# EAGLE design IO4-IR-Detector-GBunza (EAGLE 7.7.0)
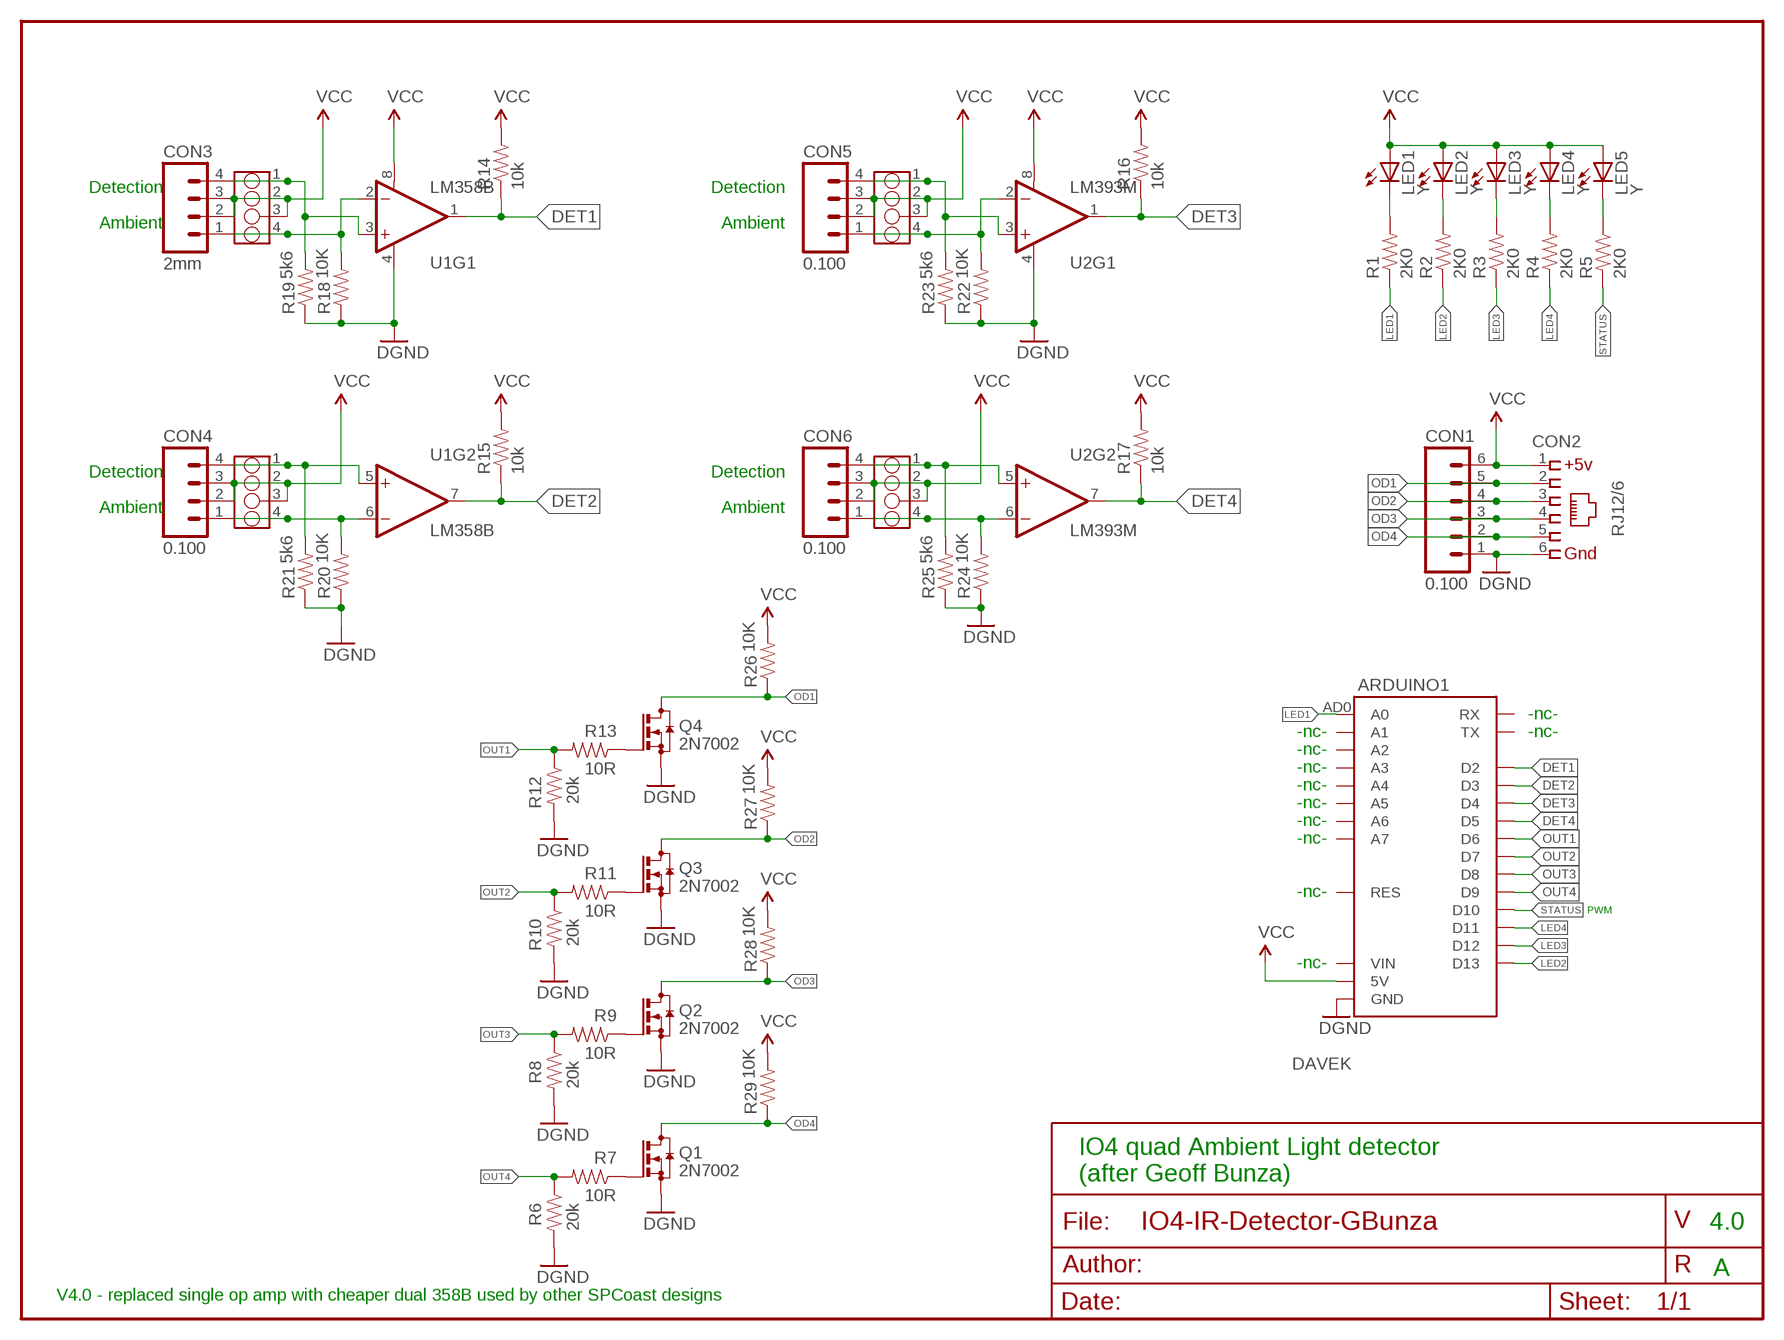
[diagram p0: schematic, sheet 1]

## Parts
ARDUINO1  DAVEK  ARDUINO-PRO-MINIDAVESROBOT  [ARDUINO_PRO_MINI_DAVEK]
CON1  0.100  CONNECTOR-M06LOCK  [1X06_LOCK]
CON2  RJ12/6  CONNECTOR-IO4INV  [RJ25-INVERTED]
CON3  2mm  CONNECTOR-M04LOCK  [1X04_LOCK]
CON4  0.100  CONNECTOR-M04LOCK  [1X04_LOCK]
CON5  0.100  CONNECTOR-M04LOCK  [1X04_LOCK]
CON6  0.100  CONNECTOR-M04LOCK  [1X04_LOCK]
DET1  2mm  CONNECTOR-GROVE-4P-2.0-3470130P1  [4P-2.0]
DET2  2mm  CONNECTOR-GROVE-4P-2.0-3470130P1  [4P-2.0]
DET3  2mm  CONNECTOR-GROVE-4P-2.0-3470130P1  [4P-2.0]
DET4  2mm  CONNECTOR-GROVE-4P-2.0-3470130P1  [4P-2.0]
LED1  Y  LED0603-LED  [0603-LED]
LED2  Y  LED0603-LED  [0603-LED]
LED3  Y  LED0603-LED  [0603-LED]
LED4  Y  LED0603-LED  [0603-LED]
LED5  Y  LED0603-LED  [0603-LED]
Q1  2N7002  BSS123  [SOT23]
Q2  2N7002  BSS123  [SOT23]
Q3  2N7002  BSS123  [SOT23]
Q4  2N7002  BSS123  [SOT23]
R1  2K0  R0603-RES  [0603-RES]
R2  2K0  R0603-RES  [0603-RES]
R3  2K0  R0603-RES  [0603-RES]
R4  2K0  R0603-RES  [0603-RES]
R5  2K0  R0603-RES  [0603-RES]
R6  20k  R0603-RES  [0603-RES]
R7  10R  R0603-RES  [0603-RES]
R8  20k  R0603-RES  [0603-RES]
R9  10R  R0603-RES  [0603-RES]
R10  20k  R0603-RES  [0603-RES]
R11  10R  R0603-RES  [0603-RES]
R12  20k  R0603-RES  [0603-RES]
R13  10R  R0603-RES  [0603-RES]
R14  10k  R0603-RES  [0603-RES]
R15  10k  R0603-RES  [0603-RES]
R16  10k  R0603-RES  [0603-RES]
R17  10k  R0603-RES  [0603-RES]
R18  10K  R0603-RES  [0603-RES]
R19  5k6  R0603-RES  [0603-RES]
R20  10K  R0603-RES  [0603-RES]
R21  5k6  R0603-RES  [0603-RES]
R22  10K  R0603-RES  [0603-RES]
R23  5k6  R0603-RES  [0603-RES]
R24  10K  R0603-RES  [0603-RES]
R25  5k6  R0603-RES  [0603-RES]
R26  10K  R0603-RES  [0603-RES]
R27  10K  R0603-RES  [0603-RES]
R28  10K  R0603-RES  [0603-RES]
R29  10K  R0603-RES  [0603-RES]
U1  LM358B  LM393M  [SO08]
U2  LM393M  [SO08]

## Nets
DET1: ARDUINO1.D2 R14.1 U1.1(OUT)
DET2: ARDUINO1.D3 R15.1 U1.7(OUT)
DET3: ARDUINO1.D4 R16.1 U2.1(OUT)
DET4: ARDUINO1.D5 R17.1 U2.7(OUT)
GND: ARDUINO1.GND@1(GND) ARDUINO1.GND@2(GND) ARDUINO1.GND@4(GND) CON1.1 CON2.6 Q1.2(S) Q2.2(S) Q3.2(S) Q4.2(S) R6.2 R8.2 R10.2 R12.2 R18.1 R19.1 R20.1 R21.1 R22.1 R23.1 R24.1 R25.1 U1.4(V-) U2.4(V-) ; supply symbol labelled DGND
LED1: ARDUINO1.AD0(A0) R1.1
LED2: ARDUINO1.D13 R2.1
LED3: ARDUINO1.D12 R3.1
LED4: ARDUINO1.D11 R4.1
N$1: LED5.C R5.1
N$2: LED4.C R4.2
N$3: LED3.C R3.2
N$4: LED2.C R2.2
N$7: LED1.C R1.2
N$9: CON3.1 DET1.4 R18.2 U1.2(-IN)
N$10: CON4.1 DET2.4 R20.2 U1.6(-IN)
N$12: CON4.4 DET2.1 R21.2 U1.5(+IN)
N$13: CON5.1 DET3.4 R22.2 U2.2(-IN)
N$14: CON5.4 DET3.1 R23.2 U2.3(+IN)
N$15: CON6.1 DET4.4 R24.2 U2.6(-IN)
N$16: CON6.4 DET4.1 R25.2 U2.5(+IN)
N$17: Q4.1(G) R13.1
N$19: CON3.4 DET1.1 R19.2 U1.3(+IN)
N$20: Q3.1(G) R11.1
N$21: Q2.1(G) R9.1
N$22: Q1.1(G) R7.1
OD1: CON1.5 CON2.2 Q4.3(D) R26.1
OD2: CON1.4 CON2.3 Q3.3(D) R27.1
OD3: CON1.3 CON2.4 Q2.3(D) R28.1
OD4: CON1.2 CON2.5 Q1.3(D) R29.1
OUT1: ARDUINO1.D6 R12.1 R13.2
OUT2: ARDUINO1.D7 R10.1 R11.2
OUT3: ARDUINO1.D8 R8.1 R9.2
OUT4: ARDUINO1.D9 R6.1 R7.2
STATUS: ARDUINO1.D10 R5.2
VCC: ARDUINO1.5V CON1.6 CON2.1 CON3.2 CON3.3 CON4.2 CON4.3 CON5.2 CON5.3 CON6.2 CON6.3 DET1.2 DET1.3 DET2.2 DET2.3 DET3.2 DET3.3 DET4.2 DET4.3 LED1.A LED2.A LED3.A LED4.A LED5.A R14.2 R15.2 R16.2 R17.2 R26.2 R27.2 R28.2 R29.2 U1.8(V+) U2.8(V+)
Unconnected: ARDUINO1.AD1(A1) ARDUINO1.AD2(A2) ARDUINO1.AD3(A3) ARDUINO1.AD4(A4) ARDUINO1.AD5(A5) ARDUINO1.AD6(A6) ARDUINO1.AD7(A7) ARDUINO1.RES ARDUINO1.RES@1(RES) ARDUINO1.RX ARDUINO1.TX@1(TX) ARDUINO1.VIN

## Notes on the sheet
- Detection | Detection
- Ambient | Ambient
- Detection | Detection
- Ambient | Ambient
- -nc-
- -nc- | -nc-
- -nc-
- -nc-
- -nc-
- -nc-
- -nc-
- -nc-
- -nc-
- PWM
- -nc-
- IO4 quad Ambient Light detector
  (after Geoff Bunza)
- 4.0
- A
- V4.0 - replaced single op amp with cheaper dual 358B used by other SPCoast designs

## Library data of the parts
ARDUINO1 = SPCoast:ARDUINO-PRO-MINI
CON1 = SPCoast:CONNECTOR-M06: Header 6 Standard 6-pin 0.1" header
CON2 = SPCoast:CONNECTOR-IO4
CON3-CON6 = SPCoast:CONNECTOR-M04: Header 4 Standard 4-pin 0.1" header. Use with straight break away headers (SKU : PRT-00116), right angle break away headers (PRT-00553), swiss pins (PRT-00743), machine pins (PRT-00117), and female headers (PRT-00115). Molex polarized connector foot print use with SKU : PRT-08231 with associated crimp pins and housings. 1MM SMD Version SKU: PRT-10208
DET1-DET4 = SPCoast:CONNECTOR-GROVE-4P-2.0
LED1-LED5 = SPCoast:LED*
Q1-Q4 = transistor-small-signal:BSS123: N-CHANNEL MOS FET
R1-R29 = SPCoast:R*: Resistor Basic schematic elements and footprints for 0603, 1206, and PTH 1/10th watt (small) resistors.
U1 U2 = SPCoast:LM393

## Board
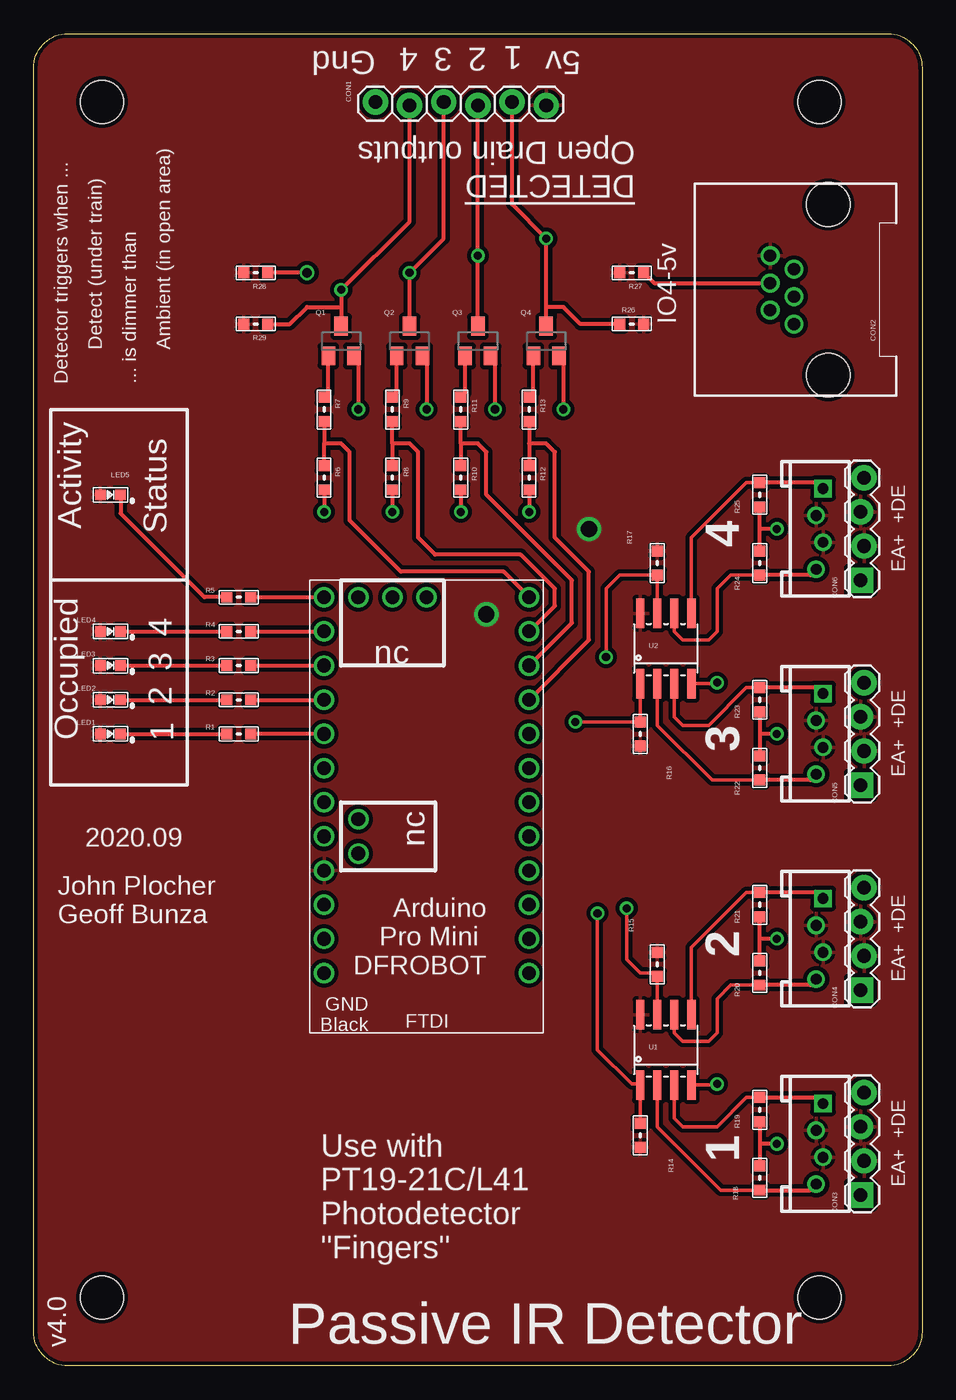
[diagram p1: board, top side]
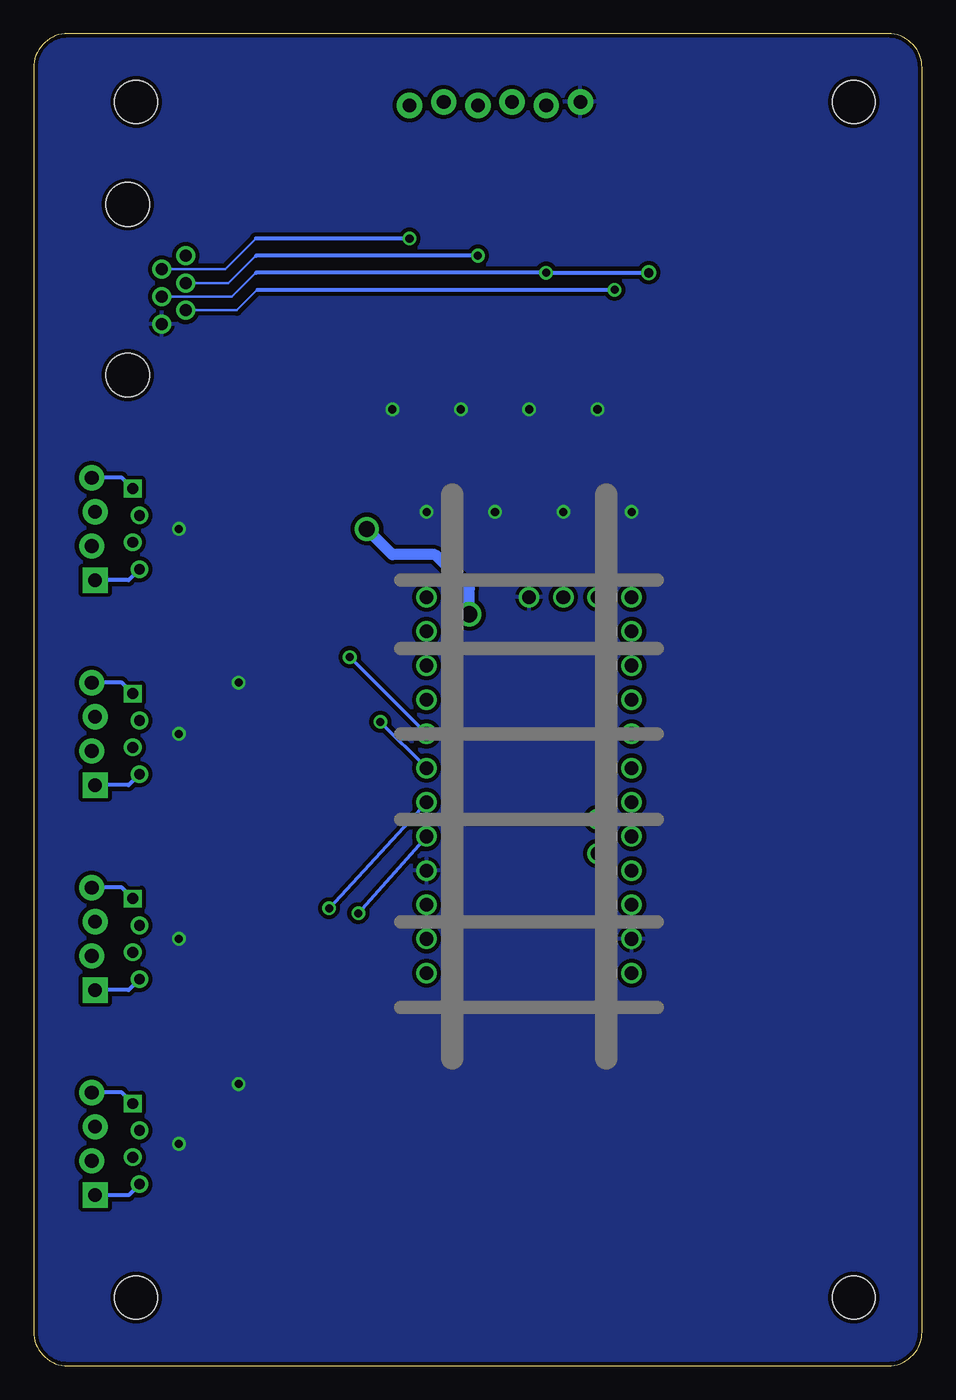
[diagram p2: board, bottom side, seen from below]

Size 66.04 x 99.06 mm. Coordinates in mm from the lower left corner, seen from the top.
Outline: 63.5,0 2.54,0 arc-90 0,2.54 0,96.52 arc-90 2.54,99.06 63.5,99.06 arc-90 66.04,96.52 66.04,2.54 arc-90 63.5,0
Copper layers (1*16): Top 0.035mm / dielectric 1.5mm / Bottom 0.035mm
Design rules "default *": minimum track width 10mil, minimum drill 0.6mm, track to track 8mil, track to pad 8mil, pad to pad 8mil, via to via 8mil, smd to smd 8mil, copper to edge 8mil, drill to drill 8mil, minimum pad ring 10mil, minimum via ring 8mil, stop-mask expansion 4mil, vias tented up to drill 0mil, thermal gap 10mil
Holes 3.2 mm at 58.42,5.08 5.08,5.08 5.08,93.98 58.42,93.98

### Footprints (pad centres in the part's own frame; a part is rotated, then mirrored left to right if it is on the bottom)
ARDUINO_PRO_MINI_DAVEK = drill 1.016: 5V 16.51,21.59; AD0 16.51,11.43; AD1 16.51,13.97; AD2 16.51,16.51; AD3 16.51,19.05; AD4 13.97,17.78; AD5 13.97,20.32; AD6 11.43,1.27; AD7 13.97,1.27; D2 1.27,19.05; D3 1.27,16.51; D4 1.27,13.97; D5 1.27,11.43; D6 1.27,8.89; D7 1.27,6.35; D8 1.27,3.81; D9 1.27,1.27; D10 16.51,1.27; D11 16.51,3.81; D12 16.51,6.35; D13 16.51,8.89; GND@1 16.51,26.67; GND@2 8.89,1.27; GND@4 1.27,21.59; RES 16.51,24.13; RES@1 1.27,24.13; RX 1.27,26.67; TX@1 1.27,29.21; VIN 16.51,29.21
1X06_LOCK = drill 1.016 pad 1.88: 1 0,0; 2 2.54,-0.254; 3 5.08,0; 4 7.62,-0.254; 5 10.16,0; 6 12.7,-0.254
RJ25-INVERTED = drill 0.9 pad 1.4: 1 2.54,4.318; 2 1.524,2.54; 3 0.508,4.318; 4 -0.508,2.54; 5 -1.524,4.318; 6 -2.54,2.54 | hole 3.251: -6.35,0; 6.35,0
1X04_LOCK = drill 1.016 pad 1.88 square: 1 0,0.127 | drill 1.016 pad 1.88: 2 2.54,-0.127; 3 5.08,0.127; 4 7.62,-0.127
4P-2.0 = drill 0.8 pad 1.27 square: 1 -3,0.254 | drill 0.8 pad 1.27: 2 -1,-0.254; 3 1,0.254; 4 3,-0.254
0603-LED = smd 0.8 x 0.8: A 0.75,0; C -0.75,0
SOT23 = smd 1 x 1.4: 1 -0.95,-1.1; 2 0.95,-1.1; 3 0,1.1
0603-RES = smd 0.813 x 0.813: 1 -0.9,0; 2 0.9,0
SO08 = smd 0.61 x 2.21: 1 -1.905,-2.616; 2 -0.635,-2.616; 3 0.635,-2.616; 4 1.905,-2.616; 5 1.905,2.616; 6 0.635,2.616; 7 -0.635,2.616; 8 -1.905,2.616

### Placement (x,y rotation side)
ARDUINO1  38.1,58.42 180 top
CON1  25.4,93.98 0 top
CON2  59.05,80.01 90 top
CON3  61.59,12.7 90 top
CON4  61.59,27.94 90 top
CON5  61.59,43.18 90 top
CON6  61.59,58.42 90 top
DET1  58.42,16.51 270 top
DET2  58.42,31.75 270 top
DET3  58.42,46.99 270 top
DET4  58.42,62.23 270 top
LED1  5.71,46.99 180 top
LED2  5.71,49.53 180 top
LED3  5.71,52.07 180 top
LED4  5.71,54.61 180 top
LED5  5.71,64.77 180 top
Q1  22.86,76.2 0 top
Q2  27.94,76.2 0 top
Q3  33.02,76.2 0 top
Q4  38.1,76.2 0 top
R1  15.24,46.99 180 top
R2  15.24,49.53 180 top
R3  15.24,52.07 180 top
R4  15.24,54.61 180 top
R5  15.24,57.15 0 top
R6  21.59,66.04 270 top
R7  21.59,71.12 270 top
R8  26.67,66.04 270 top
R9  26.67,71.12 270 top
R10  31.75,66.04 270 top
R11  31.75,71.12 270 top
R12  36.83,66.04 270 top
R13  36.83,71.12 270 top
R14  45.09,17.14 270 top
R15  46.35,29.84 90 top
R16  45.09,46.99 270 top
R17  46.35,59.69 90 top
R18  53.98,13.97 270 top
R19  53.98,19.05 90 top
R20  53.98,29.21 270 top
R21  53.98,34.29 90 top
R22  53.98,44.45 270 top
R23  53.98,49.53 90 top
R24  53.98,59.69 270 top
R25  53.98,64.77 90 top
R26  44.45,77.47 0 top
R27  44.45,81.28 180 top
R28  16.51,81.28 180 top
R29  16.51,77.47 180 top
U1  46.99,23.5 0 top
U2  46.99,53.34 0 top

### Tracks (layer width: path | path; a pad name or v marks a point on that pad's centre or on a via)
DET1  (via drill 0.6)
  Top 0.254: v41.91,33.66 41.91,23.5 44.45,20.95 45.01,20.95 U1.1 R14.1
  Bottom 0.254: ARDUINO1.D2 v41.91,33.66
DET2  (via drill 0.6)
  Top 0.254: U1.7 R15.1 46.09,29.21 45.09,29.21 44.08,30.21 v44.08,34.02
  Bottom 0.254: ARDUINO1.D3 v44.08,34.02
DET3  (via drill 0.6)
  Top 0.254: v40.27,47.89 R16.1 U2.1
  Bottom 0.254: ARDUINO1.D4 v40.27,47.89
DET4  (via drill 0.6)
  Top 0.254: U2.7 R17.1 43.55,58.79 42.55,57.78 v42.55,52.7
  Bottom 0.254: ARDUINO1.D5 v42.55,52.7
GND  (via drill 0.6)
  Top 0.254: U1.4 50.72,20.88 v50.8,20.95 | U2.4 50.72,50.72 v50.8,50.8
  Top 0.305: R19.1 53.98,16.51 | 53.98,16.51 R18.1 | v55.24,16.51 53.98,16.51 | R24.1 53.98,62.23 | 53.98,62.23 R25.1 | R23.1 53.98,46.99 | 53.98,46.99 R22.1 | R20.1 53.98,31.75 | 53.98,31.75 R21.1 | v55.24,62.23 53.98,62.23 | v55.24,46.99 53.98,46.99 | v55.24,31.75 53.98,31.75 | R6.2 v21.59,63.5 | R8.2 v26.67,63.5 | R10.2 v31.75,63.5 | R12.2 v36.83,63.5 | Q4.2 39.37,74.78 v39.37,71.12 | Q3.2 34.29,74.78 v34.29,71.12 | Q2.2 29.21,74.78 v29.21,71.12 | Q1.2 24.13,74.78 v24.13,71.12
  pour Bottom (isolate 0.305): 66.04,0 0,0 0,99.06 66.04,99.06
LED1
  Top 0.305: ARDUINO1.AD0 R1.1
LED2
  Top 0.305: R2.1 ARDUINO1.D13
LED3
  Top 0.305: R3.1 ARDUINO1.D12
LED4
  Top 0.305: R4.1 ARDUINO1.D11
N$1
  Top 0.305: R5.1 12.7,57.15 6.46,63.38 LED5.C
N$2
  Top 0.305: LED4.C R4.2
N$3
  Top 0.305: LED3.C R3.2
N$4
  Top 0.305: LED2.C R2.2
N$7
  Top 0.305: LED1.C R1.2
N$9
  Top 0.254: U1.2 46.35,17.78 51.06,13.07 R18.2
  Top 0.305: R18.2 57.73,13.07 DET1.4
  Bottom 0.305: DET1.4 58.98,12.7 CON3.1
N$10
  Top 0.254: U1.6 47.62,24.77 48.26,24.13 50.16,24.13 50.8,24.77 50.8,27.3 51.8,28.31 R20.2
  Top 0.305: DET2.4 57.73,28.31 R20.2
  Bottom 0.305: DET2.4 58.98,27.94 CON4.1
N$12
  Top 0.254: R21.2 52.97,35.19 48.9,31.11 U1.5
  Top 0.305: DET2.1 58.23,35.19 R21.2
  Bottom 0.305: DET2.1 59.48,35.56 CON4.4
N$13
  Top 0.254: R22.2 50.43,43.55 46.35,47.62 U2.2
  Top 0.305: DET3.4 57.73,43.55 R22.2
  Bottom 0.305: DET3.4 58.98,43.18 CON5.1
N$14
  Top 0.254: R23.2 52.97,50.43 50.16,47.62 48.26,47.62 47.62,48.26 U2.3
  Top 0.305: DET3.1 58.23,50.43 R23.2
  Bottom 0.305: DET3.1 59.48,50.8 CON5.4
N$15
  Top 0.254: U2.6 47.62,54.61 48.26,53.98 50.16,53.98 50.8,54.61 50.8,57.78 51.8,58.79 R24.2
  Top 0.305: DET4.4 57.73,58.79 R24.2
  Bottom 0.305: DET4.4 58.98,58.42 CON6.1
N$16
  Top 0.254: R25.2 52.97,65.67 48.9,61.59 U2.5
  Top 0.305: DET4.1 58.23,65.67 R25.2
  Bottom 0.305: DET4.1 59.48,66.04 CON6.4
N$17
  Top 0.305: R13.1 37.15,72.34 Q4.1
N$19
  Top 0.254: U1.3 47.62,18.41 48.26,17.78 50.8,17.78 52.97,19.95 R19.2
  Top 0.305: R19.2 58.23,19.95 DET1.1
  Bottom 0.305: DET1.1 59.48,20.32 CON3.4
N$20
  Top 0.305: R11.1 32.07,72.34 Q3.1
N$21
  Top 0.305: R9.1 26.99,72.34 Q2.1
N$22
  Top 0.305: R7.1 21.91,72.34 Q1.1
OD1  (via drill 0.6)
  Top 0.305: Q4.3 38.1,78.74 | 38.1,78.74 v38.1,83.82 35.56,86.36 CON1.5 | R26.1 40.64,77.47 39.37,78.74 38.1,78.74
  Bottom 0.203: 49.53,83.82 51.82,81.53 CON2.2
  Bottom 0.305: v38.1,83.82 49.53,83.82
OD2  (via drill 0.6)
  Top 0.305: Q3.3 v33.02,82.55 CON1.4 | R27.1 46.11,80.52 CON2.3
  Bottom 0.203: 49.53,82.55 51.56,80.52 CON2.3
  Bottom 0.305: v33.02,82.55 49.53,82.55
OD3  (via drill 0.6, 0.7)
  Top 0.305: Q2.3 v27.94,81.28 30.48,83.82 CON1.3 | v20.32,81.28 R28.1
  Bottom 0.203: 49.53,81.28 51.31,79.5 CON2.4
  Bottom 0.305: 49.53,81.28 v27.94,81.28 v20.32,81.28
OD4  (via drill 0.6)
  Top 0.305: 22.86,78.74 v22.86,80.01 27.94,85.09 CON1.2 | 22.86,78.74 Q1.3 | R29.1 19.05,77.47 20.32,78.74 22.86,78.74
  Bottom 0.203: 49.4,80.01 50.93,78.49 CON2.5
  Bottom 0.305: 49.4,80.01 v22.86,80.01
OUT1
  Top 0.305: ARDUINO1.D6 41.27,53.98 41.27,59.05 38.73,61.59 38.73,67.94 38.1,68.58 36.83,68.58 | 36.83,68.58 R12.1 | R13.2 36.83,68.58
OUT2
  Top 0.305: ARDUINO1.D7 40.01,55.24 40.01,58.42 33.66,64.77 33.66,67.94 33.02,68.58 31.75,68.58 | 31.75,68.58 R11.2 | 31.75,68.58 R10.1
OUT3
  Top 0.305: ARDUINO1.D8 38.73,56.52 38.73,57.78 36.2,60.33 29.84,60.33 28.57,61.59 28.57,67.94 27.94,68.58 26.67,68.58 | 26.67,68.58 R9.2 | 26.67,68.58 R8.1
OUT4
  Top 0.305: ARDUINO1.D9 34.92,59.05 27.3,59.05 23.5,62.87 23.5,67.94 22.86,68.58 21.59,68.58 | R6.1 21.59,68.58 | R7.2 21.59,68.58
STATUS
  Top 0.305: R5.2 ARDUINO1.D10
VCC  (via drill 1.2)
  Bottom 0.813: v33.66,55.88 33.66,57.78 36.2,60.33 39.37,60.33 v41.27,62.23
  pour Top (isolate 0.305): 66.04,0 0,0 0,99.06 66.04,99.06

### Text on the board
tPlace: Gnd | 4 | 3 | 2 | 1 | 5v | !DETECTED! / Open Drain outputs | IO4-5v | Detect (under train) | Ambient (in open area) | Detector triggers when ... | ... is dimmer than | Activity | Status | 4 | EA+ +DE | Occupied | 4 | nc | 3 | 2 | 3 | 1 | EA+ +DE | nc | 2020.09 | Arduino / Pro Mini / DFROBOT | John Plocher / Geoff Bunza | 2 | EA+ +DE | 1 | EA+ +DE | Use with / PT19-21C/L41 / Photodetector / "Fingers" | Passive IR Detector | v4.0
bDocu: Made in the PCR, Coast Division, NMRA | www.SPCoast.com | Passive IR Detector | Go Bears! | Model Railroading is Fun!